# EasyEDA Pro project ProPrj_M0G3507电赛稳压板_2025-04-02 2025-7-14 232358 5.epro

# Schematic M0G3507电赛稳压板
Create Date: 2024-07-20; Page Name: M0G3507电赛稳压板; Project Name: M0G3507电赛稳压板; Schematic Name: M0G3507电赛稳压板; Update Date: 2024-07-20; Company: 嘉立创EDA; Page Size: A4; Version: V1.0
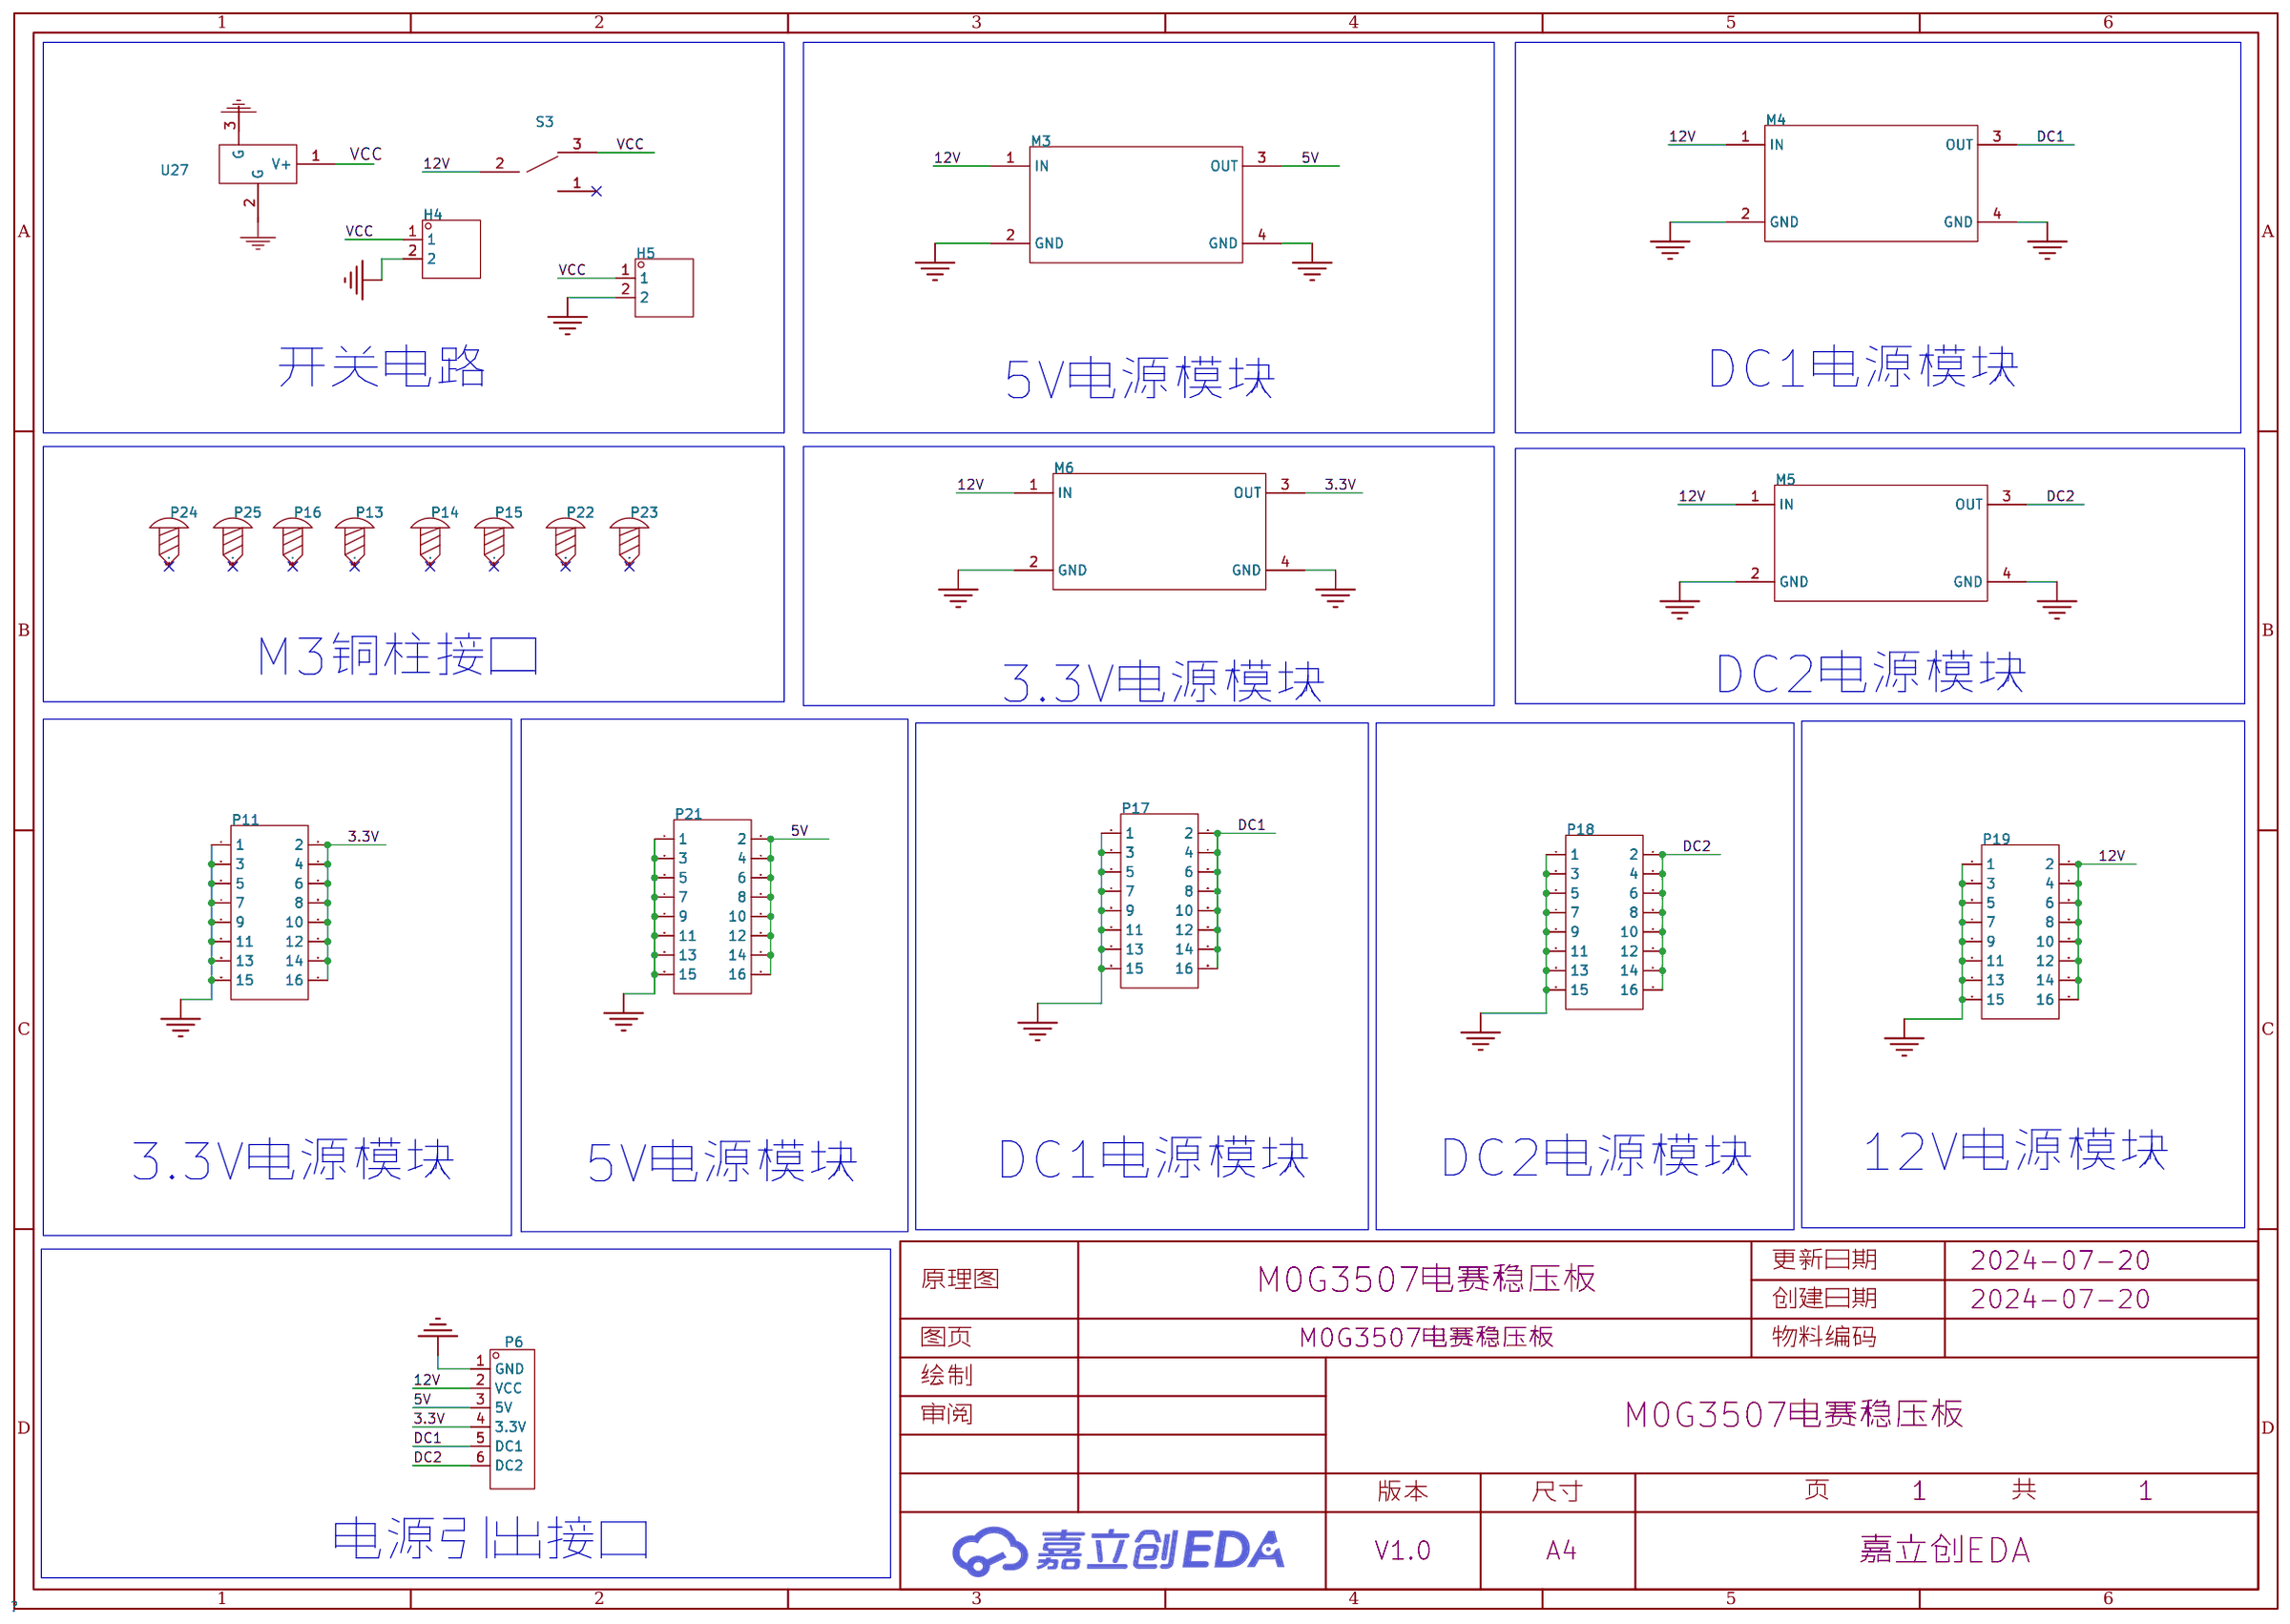
[diagram p0: schematic sheet]

## Parts
H4  -  [HDR-TH_2P-P2.54-V-M-1]
H5  -  [HDR-TH_2P-P2.54-V-M-1]
M3  -  [LM2596稳压模块]
M4  -  [LM2596稳压模块]
M5  -  [LM2596稳压模块]
M6  -  [LM2596稳压模块]
P6  2.54pitch 6P  [footprint_2943]
P11  2.54-2*8P针  [HDR-TH_16P-P2.54-IO]
P13  -  [M3螺丝]
P14  -  [M3螺丝]
P15  -  [M3螺丝]
P16  -  [M3螺丝]
P17  2.54-2*8P针  [HDR-TH_16P-P2.54-IO]
P18  2.54-2*8P针  [HDR-TH_16P-P2.54-IO]
P19  2.54-2*8P针  [HDR-TH_16P-P2.54-IO]
P21  2.54-2*8P针  [HDR-TH_16P-P2.54-IO]
P22  -  [M3螺丝]
P23  -  [M3螺丝]
P24  -  [M3螺丝]
P25  -  [M3螺丝]
S3  拨动开关  [footprint_4303]
U27  DC母座5.5 2.1  [footprint_a1df]

## Library data of the parts
H4 H5 = 2.54-1*2P-排针: 间距:2.54mm;总PIN位数:2;排数:1;插针结构:1x2P;行距:-;安装类型:直插;圆针/方针:-;额定电流:-;额定电压:-;配合针长度:6mm;塑高:2.54mm;端接针长度:3mm;触头材质:黄铜;触头镀层:-;工作温度范围:-40℃~+105℃;颜色:黑色;; LCSC Part Name: 2.54mm 1x2P; Supplier Part: C124375; Manufacturer: Ckmtw(灿科盟); Manufacturer Part: B-2100S02P-A110; Supplier Footprint: 插件,P=2.54mm; JLCPCB Part Class: 扩展库; Datasheet: https://atta.szlcsc.com/upload/public/pdf/source/20170821/C124375_1503303305760901527.pdf; Supplier: LCSC; Pitch: 2.54mm; Number of Pins: 2; Number of Rows: 1; Pin Structure: 1x2P; Mounting Type: 直插; Length of Mating Pin: 6mm; Insulation Height: 2.54mm; Length of End Connection Pin: 3mm; Contact Material: 黄铜; Operating Temperature Range: -40℃~+105℃; Color: 黑色
M3-M6 = LM2596稳压模块: 直流稳压模块LM2596S; _: 3
P6 = 2.54pitch 6P: Supplier: LCSC; Manufacturer: BOOMELE(博穆精密); Manufacturer Part: 杜邦2.54-6A弯针; Supplier Part: C24361; JLCPCB Part Class: Extended Part
P11 P17-P19 P21 = 2.54-2*8P排针: 排数:双排;总PIN位数:16P;间距:2.54mm;插针结构:2x8P;行距:2.54mm;安装类型:直插;圆针/方针:方针;额定电流:-;额定电压:-;配合针长度:5.9mm;塑高:2.54mm;端接针长度:-;触头材质:-;触头镀层:-;工作温度范围:-;焊接温度(最大值):-;颜色:黑色;; Supplier: LCSC; Manufacturer: BOOMELE(博穆精密); Supplier Part: C68234; JLCPCB Part Class: 扩展库; LCSC Part Name: 2.54mm 2x8P 直插 方针; Supplier Footprint: 插件,P=2.54mm; Datasheet: https://atta.szlcsc.com/upload/public/pdf/source/20221018/3E9408392E35E6F57A28985E5F7BF5C9.pdf; Number of Rows: 双排; Number of Pins: 16P; Pitch: 2.54mm; Pin Structure: 2x8P; Row Spacing: 2.54mm; Mounting Type: 直插; Circluar Pins/Square Pins: 方针; Length of Mating Pin: 5.9mm; Insulation Height: 2.54mm; Color: 黑色
P13-P16 P22-P25 = M3螺丝: Supplier Footprint: 插件; Check: false
S3 = 拨动开关: Published: 24-Mar-1999; Publisher: Altium Limited; Price(RMB): 0.000
U27 = DC母座5.5 2.1

## Nets
3.3V: M6.3(OUT) P6.4(3.3V) P11.2 P11.4 P11.6 P11.8 P11.10 P11.12 P11.14 P11.16
5V: M3.3(OUT) P6.3(5V) P21.2 P21.4 P21.6 P21.8 P21.10 P21.12 P21.14 P21.16
12V: M3.1(IN) M4.1(IN) M5.1(IN) M6.1(IN) P6.2(VCC) P19.2 P19.4 P19.6 P19.8 P19.10 P19.12 P19.14 P19.16 S3.2
GND: H4.2 H5.2 M3.2(GND) M3.4(GND) M4.2(GND) M4.4(GND) M5.2(GND) M5.4(GND) M6.2(GND) M6.4(GND) P6.1(GND) P11.1 P11.3 P11.5 P11.7 P11.9 P11.11 P11.13 P11.15 P17.1 P17.3 P17.5 P17.7 P17.9 P17.11 P17.13 P17.15 P18.1 P18.3 P18.5 P18.7 P18.9 P18.11 P18.13 P18.15 P19.1 P19.3 P19.5 P19.7 P19.9 P19.11 P19.13 P19.15 P21.1 P21.3 P21.5 P21.7 P21.9 P21.11 P21.13 P21.15 U27.2(G) U27.3(G)
VCC: H4.1 H5.1 S3.3 U27.1(V+)
DC1: M4.3(OUT) P6.5(DC1) P17.2 P17.4 P17.6 P17.8 P17.10 P17.12 P17.14 P17.16
DC2: M5.3(OUT) P6.6(DC2) P18.2 P18.4 P18.6 P18.8 P18.10 P18.12 P18.14 P18.16

Not connected (* = marked no-connect by the designer): P13 1*; P14 1*; P15 1*; P16 1*; P22 1*; P23 1*; P24 1*; P25 1*; S3 1*

## Notes on the sheet
- 开关电路
- 5V电源模块
- DC1电源模块
- M3铜柱接口
- 3.3V电源模块
- DC2电源模块
- 3.3V电源模块
- 5V电源模块
- DC1电源模块
- DC2电源模块
- 12V电源模块
- 电源引出接口

# Board M0G3507电赛稳压板
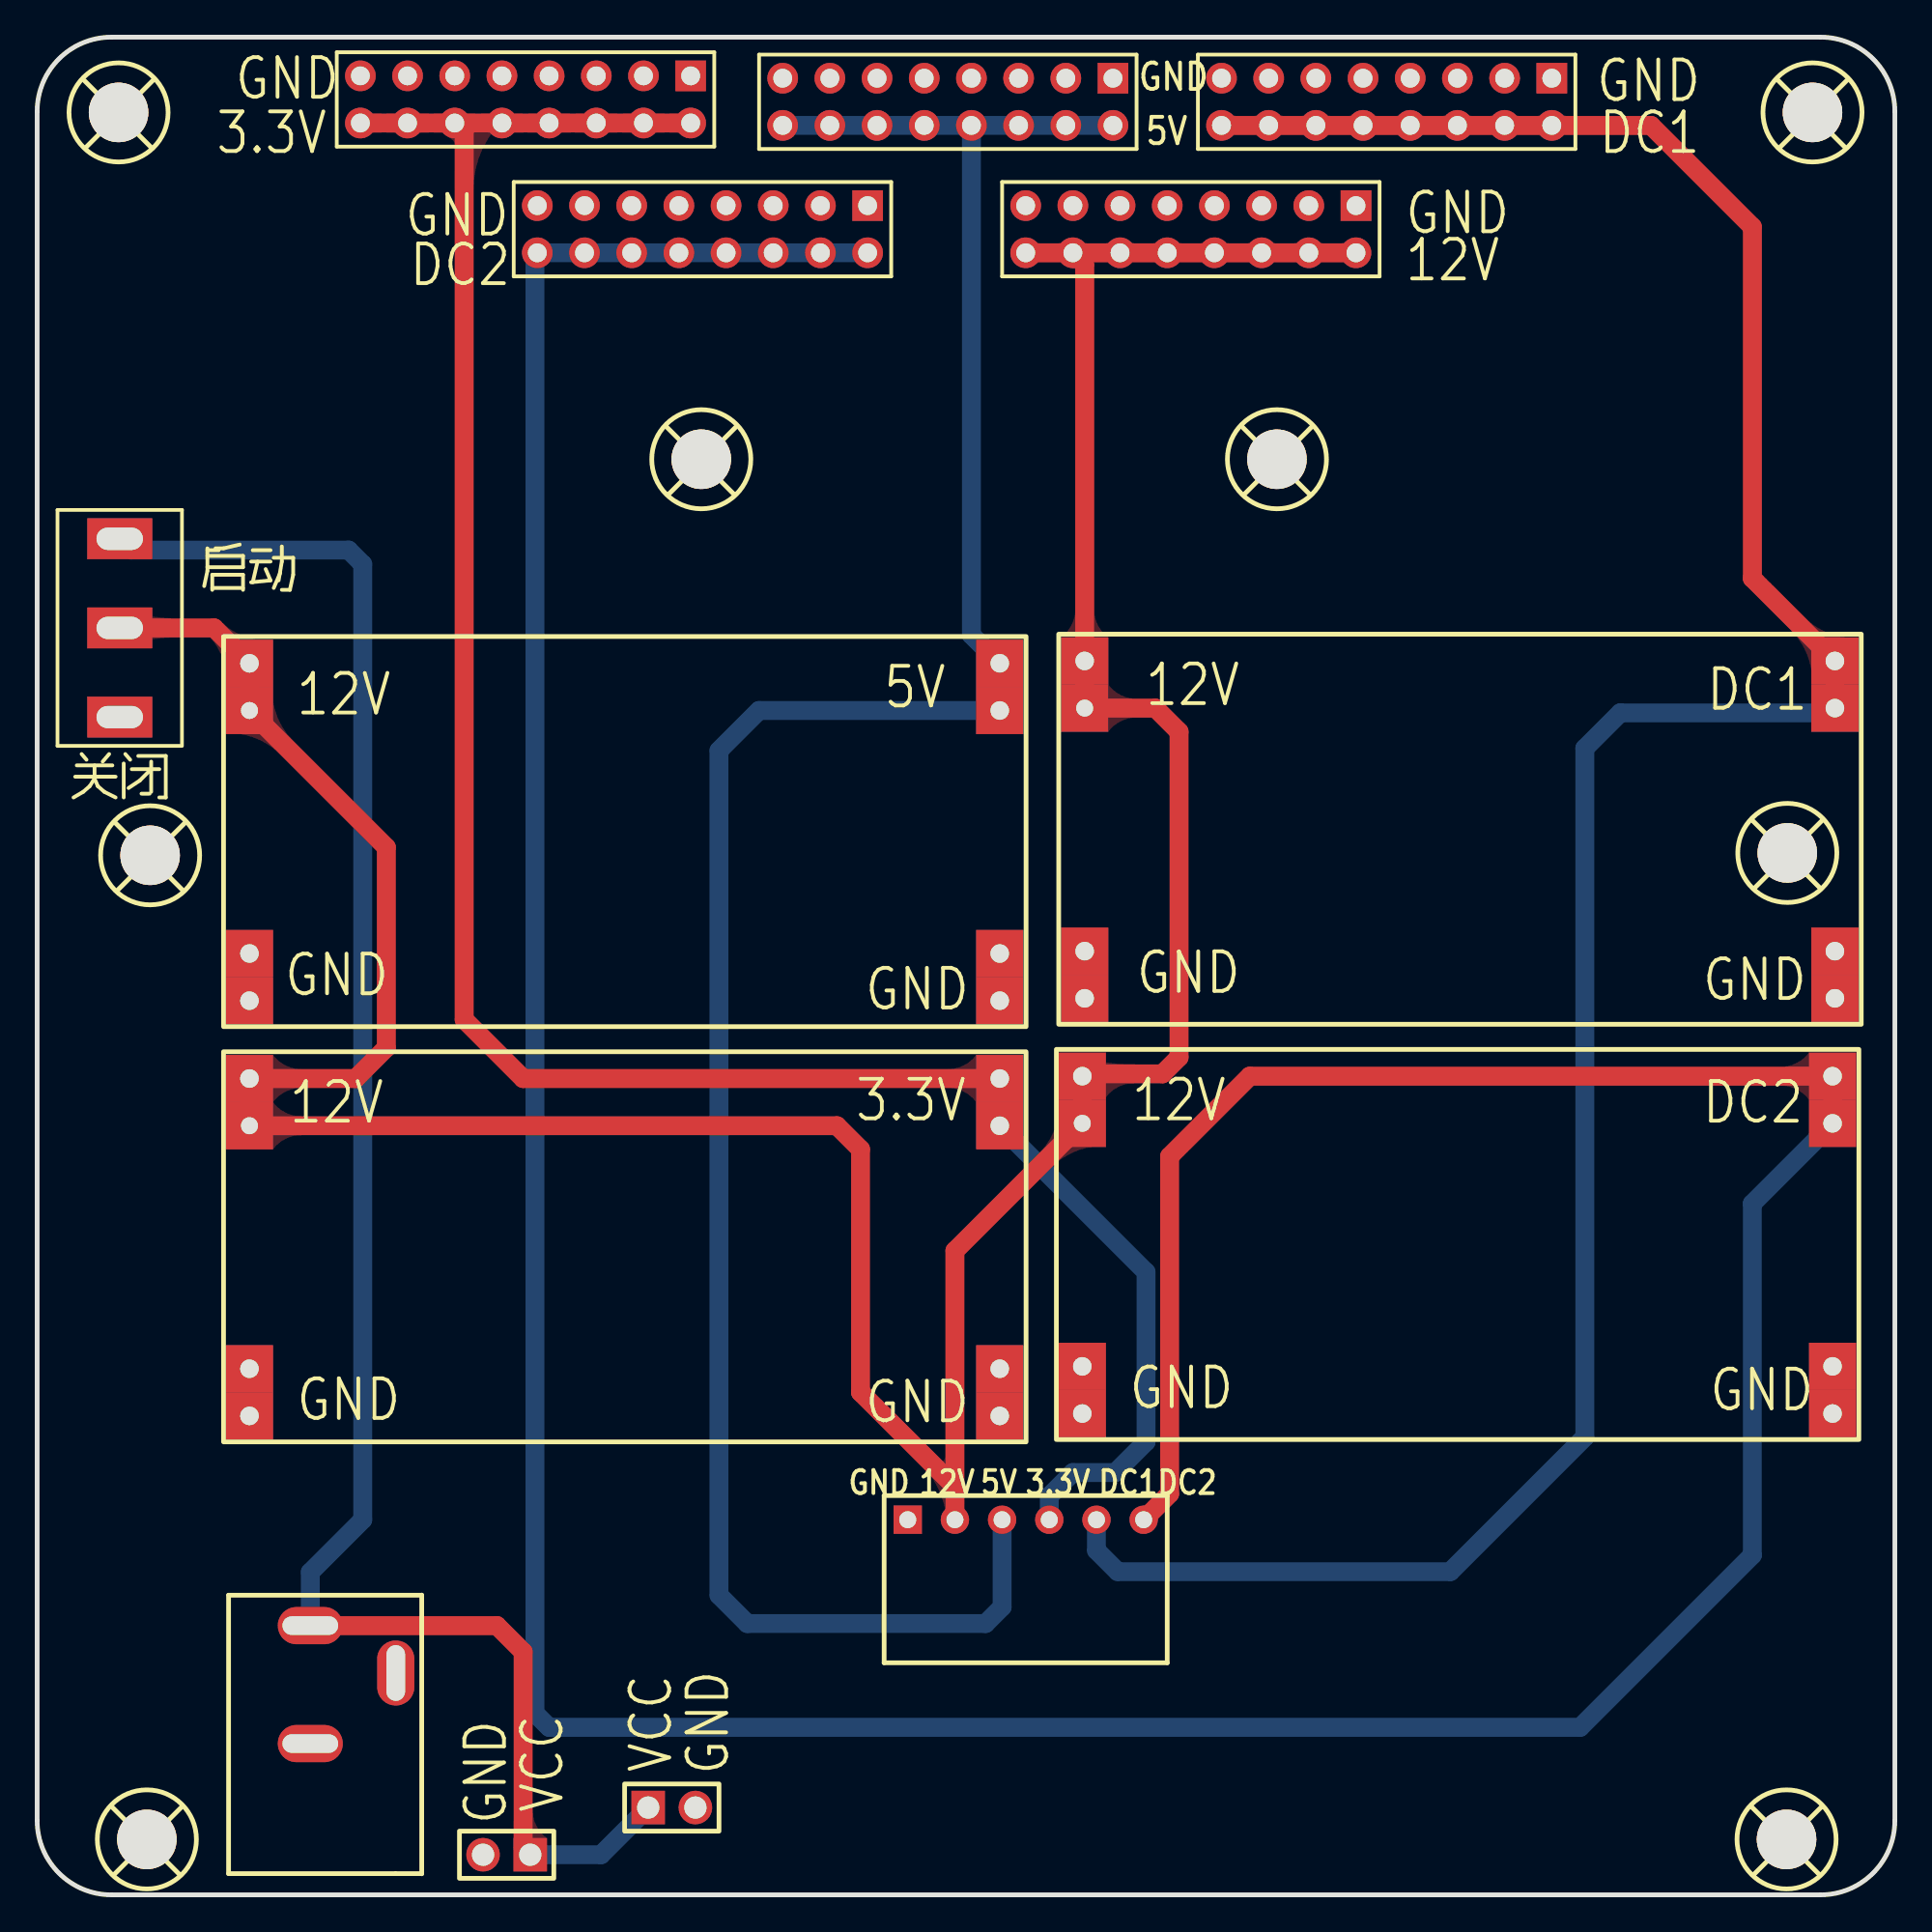
[diagram p1: board, top side]
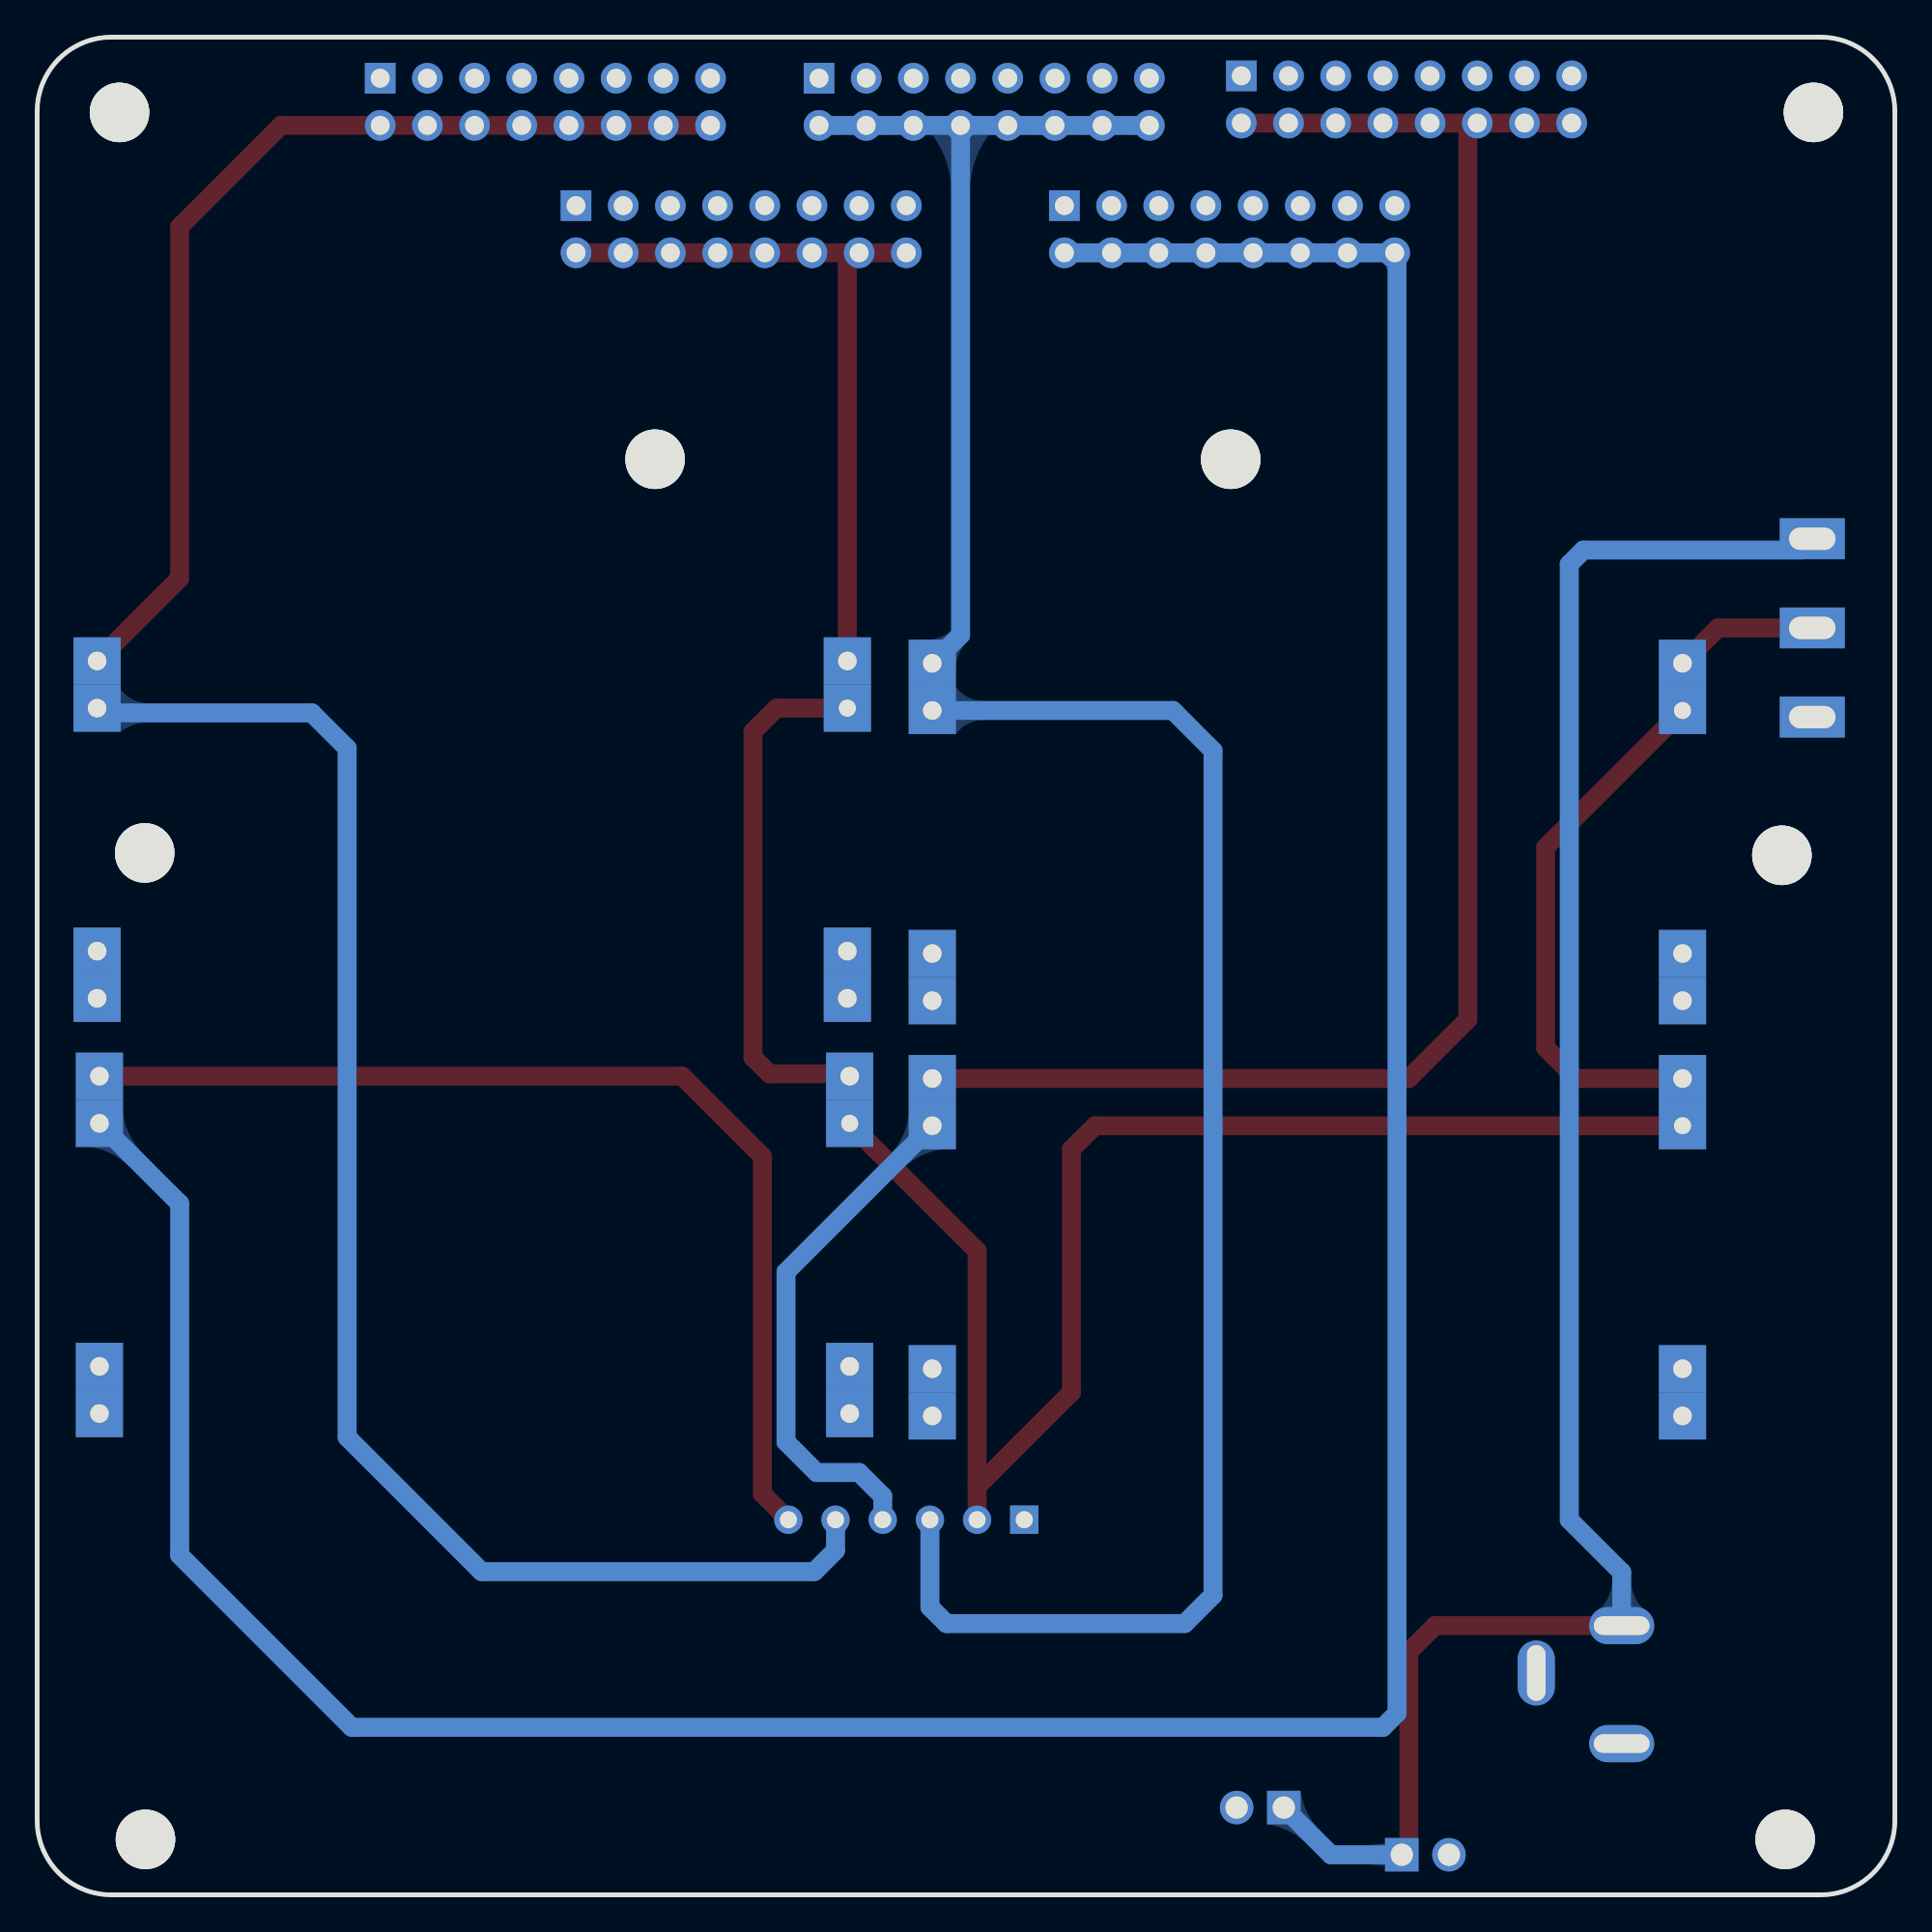
[diagram p2: board, bottom side, seen from below]

Outline 100 x 100 mm; copper layers: Top Layer, Bottom Layer. Coordinates in mm from the lower left corner of the outline.
Outline path: 0,96 0,4 arc(1.17,1.17) 4,0 96,0 arc(98.83,1.17) 100,4 100,96 arc(98.83,98.83) 96,100 4,100 arc(1.17,98.83) 0,96
Stack: Top Layer 0.035mm / Dielectric1 1.51mm FR4 er 4.5 / Bottom Layer 0.035mm

## Design rules (mm)
template: JLCPCB Capability(Two Layers Board)
spacing copperThickness1oz (default): track to track 0.102, other pairs 0.152 to 0.3
spacing copperThickness2oz: track to track 0.203, other pairs 0.152 to 0.3
track width copperThickness1oz (default): min 0.127, default 0.254, max 2.54
track width copperThickness2oz: min 0.203, default 0.254, max 2.54
differential pair differentialPair (default): width min 0.127, default 0.254, max 2.54; gap min 0.152, default 0.152
via viaSize (default): diameter min 0.5, default 0.61, max 10; hole min 0.3, default 0.305, max 6.3

## Placement (name value [footprint] x y rotation side)
H4  -  [HDR-TH_2P-P2.54-V-M-1]  25.27 2.16 180 top
H5  -  [HDR-TH_2P-P2.54-V-M-1]  34.16 4.7 0 top
M3  -  [lm2596稳压模块]  10.03 46.74 0 top
M4  -  [lm2596稳压模块]  54.99 46.86 0 top
M5  -  [lm2596稳压模块]  54.86 24.51 0 top
M6  -  [lm2596稳压模块]  10.03 24.38 0 top
P6  2.54pitch 6P  [footprint_2943]  53.21 20.19 0 top
P11  2.54-2*8P针  [HDR-TH_16P-P2.54-IO]  26.29 96.65 180 top
P13  -  [M3螺丝]  4.44 95.89 0 top
P14  -  [M3螺丝]  94.23 2.92 0 top
P15  -  [M3螺丝]  95.63 95.89 0 top
P16  -  [M3螺丝]  5.97 2.92 0 top
P17  2.54-2*8P针  [HDR-TH_16P-P2.54-IO]  72.64 96.52 180 top
P18  2.54-2*8P针  [HDR-TH_16P-P2.54-IO]  35.81 89.66 180 top
P19  2.54-2*8P针  [HDR-TH_16P-P2.54-IO]  62.1 89.66 180 top
P21  2.54-2*8P针  [HDR-TH_16P-P2.54-IO]  49.02 96.52 180 top
P22  -  [M3螺丝]  94.27 56.02 0 top
P23  -  [M3螺丝]  35.81 77.22 0 top
P24  -  [M3螺丝]  66.8 77.22 0 top
P25  -  [M3螺丝]  6.14 55.9 0 top
S3  拨动开关  [footprint_4303]  4.44 68.2 90 top
U27  DC母座5.5 2.1  [footprint_a1df]  19.3 1.14 90 top

## Footprints (pads in the part's own frame, mm; a bottom-side part is the same pattern mirrored in y, then rotated)
footprint_2943
  rect 1.524x1.524 hole 0.914: 1(-6.35,0)
  round 1.524 hole 0.914: 2(-3.81,0) 3(-1.27,0) 4(1.27,0) 5(3.81,0) 6(6.35,0)
footprint_4303
  rect 2.2x3.5 hole 1.2x2.5: 1(-4.8,0) 2(0,0) 3(4.8,0)
footprint_a1df
  oval 2x3.5 hole 1x3: 1(13.35,4.6) 3(7,4.6)
  oval 3.5x2 hole 3x1: 2(10.8,0)
HDR-TH_2P-P2.54-V-M-1
  rect 1.801x1.801 hole 1.199: 1(-1.27,0)
  round 1.801 hole 1.199: 2(1.27,0)
HDR-TH_16P-P2.54-IO
  rect 1.651x1.651 hole 1.016: 1(-8.89,-1.27)
  round 1.651 hole 1.016: 2(-8.89,1.27) 3(-6.35,-1.27) 4(-6.35,1.27) 5(-3.81,-1.27) 6(-3.81,1.27) 7(-1.27,-1.27) 8(-1.27,1.27) 9(1.27,-1.27) 10(1.27,1.27) 11(3.81,-1.27) 12(3.81,1.27) 13(6.35,-1.27) 14(6.35,1.27) 15(8.89,-1.27) 16(8.89,1.27)
lm2596稳压模块
  rect 2.54x2.54 hole 1: 1(1.397,19.558) 2(1.397,3.937) 2(1.397,1.397) 3(41.783,19.558) 3(41.783,17.018) 4(41.783,3.937) 4(41.783,1.397)
  rect 2.54x2.54 hole 0.914: 1(1.397,17.018)
M3螺丝
  round 3.2 hole 3.2: 1(-0.064,0.064)

## Nets
As in the schematic.

Pads without a net: P13 1; P14 1; P15 1; P16 1; P22 1; P23 1; P24 1; P25 1; S3 1

## Routing (per net, layer and track width the routed paths; a pad name or vN(x,y) marks a point on that pad's centre or on a via; arc(x,y) is an arc through that point)
3.3V: length 124.4
  Top Layer w1.016: P11.16 P11.14 P11.12 ; P11.2 P11.4 P11.6 P11.8 P11.10 P11.12 ; P11.12 22.99,94.87 22.99,47.12 26.16,43.94 M6.3
  Bottom Layer w1.016: M6.3 59.69,33.53 59.69,24.38 58.04,22.73 55.75,22.73 54.48,21.46 P6.4
5V: length 132.3
  Bottom Layer w1.016: P21.16 P21.14 P21.12 P21.10 P21.8 ; P21.8 P21.6 P21.4 P21.2 ; P21.8 50.29,67.82 M3.3 M3.3 38.86,63.75 36.7,61.59 36.7,16.13 38.23,14.6 51.05,14.6 51.94,15.49 51.94,20.19
12V: length 193.8
  Top Layer w1.016: P19.14 56.39,87.76 M4.1 M4.1 60.2,63.88 61.47,62.61 61.47,45.08 60.58,44.2 56.39,44.2 M5.1 M5.1 49.4,34.67 49.4,21.97 ; P19.14 53.21,88.39 ; P19.14 P19.12 P19.10 P19.6 P19.4 P19.2 ; 49.4,21.97 44.32,27.05 44.32,40.13 43.05,41.4 M6.1 M6.1 17.14,43.94 18.8,45.59 18.8,56.39 M3.1 M3.1 9.53,68.2 S3.2 ; 49.4,21.97 P6.2
VCC: length 102.5
  Top Layer w1.016: U27.1 24.75,14.49 26.16,13.08 26.16,2.54 26.54,2.16
  Bottom Layer w1.016: H5.1 30.35,2.16 26.54,2.16 ; U27.1 14.7,17.37 17.53,20.19 17.53,71.63 16.76,72.39 5.05,72.39 S3.3
DC1: length 141.4
  Top Layer w1.016: M4.3 M4.3 92.33,70.87 92.33,89.79 86.87,95.25 P17.2 P17.4 P17.6 P17.8 P17.10 P17.12 P17.14 P17.16
  Bottom Layer w1.016: M4.3 96.52,63.63 85.22,63.63 83.31,61.72 83.31,24.64 76.07,17.4 58.17,17.4 57.02,18.54 P6.5
DC2: length 251.3
  Top Layer w1.016: P6.6 60.96,21.59 60.96,39.75 65.28,44.07 M5.3 M5.3
  Bottom Layer w1.016: P18.2 P18.4 P18.6 P18.8 P18.10 P18.12 P18.14 P18.16 26.8,88.27 26.8,9.78 27.56,9.02 83.06,9.02 92.33,18.29 92.33,37.21 M5.3

## Copper pours and planes (outline as drawn; the poured copper is in the pictures)
GND on Top Layer: -15.37,106.3 114.05,106.3 114.05,-8.25 -15.37,-8.25
GND on Bottom Layer: -22.1,108.59 124.59,108.59 124.59,-8.89 -22.1,-8.89

Small or netless copper shapes (teardrops, artwork), in the pictures only: 83 on Top Layer, 46 on Bottom Layer

## Text on the board
Top Silkscreen Layer: GND | 12V | 5V | 3.3V | DC1 | DC2 | VCC | 关闭 | 启动
